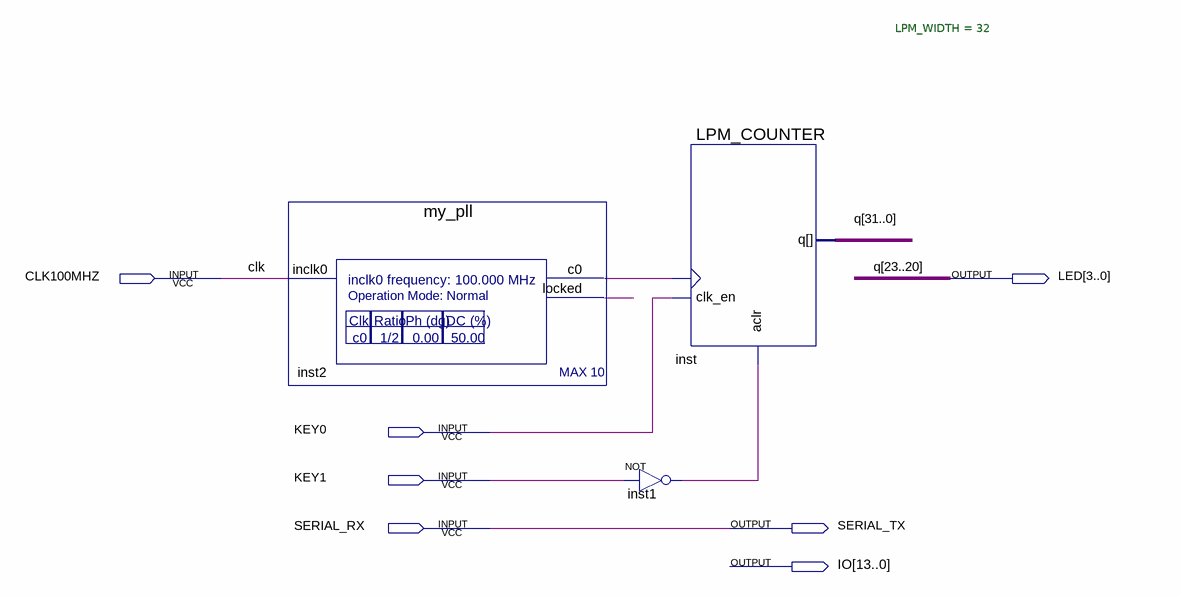
[diagram p0: schematic sheet]
// Quartus schematic max10_02.bdf as structural Verilog: 3 symbols, 7 pins
module max10_02 (
  input  CLK100MHZ,
  input  KEY0,
  input  KEY1,
  input  SERIAL_RX,
  output [3:0] LED,
  output SERIAL_TX,
  output [13:0] IO
);

  wire inst1_out, inst2_c0, inst2_locked;
  wire [31:0] q;

  my_pll inst2 (.inclk0(CLK100MHZ), .c0(inst2_c0), .locked(inst2_locked));
  not inst1 (inst1_out, KEY1);
  LPM_COUNTER #(.LPM_WIDTH(32)) inst (.aclr(inst1_out), .clk_en(KEY0), .clock(inst2_c0), .q({q[31:24], LED, q[19:0]}));

  assign SERIAL_TX = SERIAL_RX;

  // Other names for the same wires on the sheet: clk = CLK100MHZ; q[23:20] = LED
endmodule
